# EAGLE design QuadOpAmp (EAGLE 7.2.0)
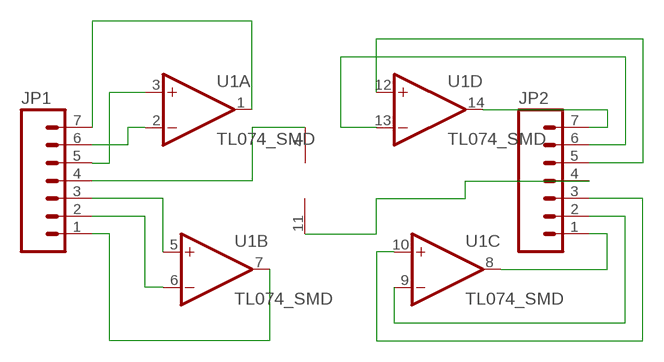
[diagram p0: schematic, sheet 1]

## Parts
JP1  M07LOCK  [1X07_LOCK]
JP2  M07LOCK  [1X07_LOCK]
U1  TL074_SMD  [SO14]

## Nets
N$1: JP1.1 U1.7(B:OUT)
N$2: JP1.2 U1.6(B:-IN)
N$3: JP1.3 U1.5(B:+IN)
N$5: JP1.7 U1.1(A:OUT)
N$6: JP1.6 U1.2(A:-IN)
N$7: JP1.5 U1.3(A:+IN)
N$9: JP2.1 U1.8(C:OUT)
N$10: JP2.2 U1.9(C:-IN)
N$11: JP2.3 U1.10(C:+IN)
N$12: JP2.7 U1.14(D:OUT)
N$13: JP2.6 U1.13(D:-IN)
N$14: JP2.5 U1.12(D:+IN)
PWR+: JP1.4 U1.4(P:V+)
PWR-: JP2.4 U1.11(P:V-)

## Library data of the parts
JP1 JP2 = SparkFun-Connectors:M07: Header 7 Standard 7-pin 0.1" header. Use with straight break away headers (SKU : PRT-00116), right angle break away headers (PRT-00553), swiss pins (PRT-00743), machine pins (PRT-00117), and female headers (PRT-00115). NOTES ON THE VARIANTS LOCK and LOCK_LONGPADS... This footprint was designed to help hold the alignment of a through-hole component (i.e. 7-pin header) while soldering it into place. You may notice that each hole has been shifted either up or down by 0.005 of an inch from it's more standard position (which is usually a perfectly straight line). This slight alteration caused the pins (the squares in the middle) to touch the edges of the holes. Because they are alternating, it causes a "brace" to hold the header in place. 0.005 has proven to be the perfect amount of "off-center" position when using our standard breakaway headers. Although looks a little odd when you look at the bare footprint, once you have a header in there, the alteration is very hard to notice. Also, if you push a header all the way into place, it is covered up entirely on the bottom side. This idea of altering the position of holes to aid alignment will be further integrated into the Sparkfun Library for other footprints. It can help hold any component with 3 or more connection pins.
U1 = MusicThingModular:TL074: Generic Quad Op Amp

## Board
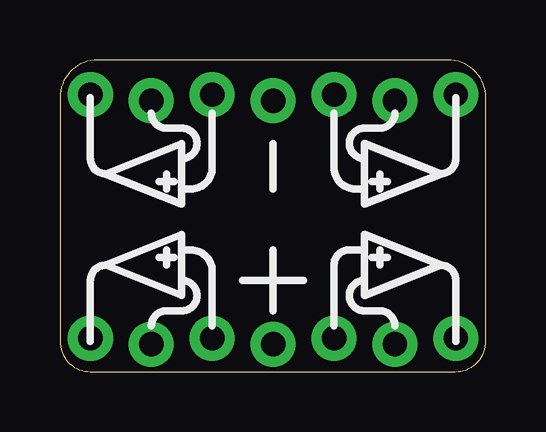
[diagram p1: board, top side]
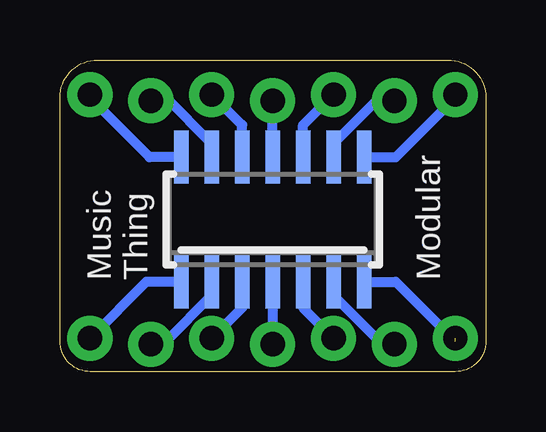
[diagram p2: board, bottom side, seen from below]

Size 17.76 x 13.01 mm. Coordinates in mm from the lower left corner, seen from the top.
Outline: 1.27,0 16.49,0 arc90 17.76,1.27 17.76,11.43 arc90 16.18,13.01 1.57,13.01 arc90 0,11.43 0,1.27 arc90 1.27,0
Copper layers (1*16): Top 0.035mm / dielectric 1.5mm / Bottom 0.035mm
Design rules "default": minimum track width 10mil, minimum drill 24mil, track to track 8mil, track to pad 8mil, pad to pad 8mil, via to via 8mil, smd to smd 8mil, copper to edge 40mil, drill to drill 8mil, minimum pad ring 10mil, minimum via ring 8mil, stop-mask expansion 4mil, vias tented up to drill 0mil, thermal gap 10mil

### Footprints (pad centres in the part's own frame; a part is rotated, then mirrored left to right if it is on the bottom)
1X07_LOCK = drill 1.016 pad 1.88: 1 0,0.127; 2 2.54,-0.127; 3 5.08,0.127; 4 7.62,-0.127; 5 10.16,0.127; 6 12.7,-0.127; 7 15.24,0.127
SO14 = smd 0.6 x 2.2: 1 -3.81,-2.6; 2 -2.54,-2.6; 3 -1.27,-2.6; 4 0,-2.6; 5 1.27,-2.6; 6 2.54,-2.6; 7 3.81,-2.6; 8 3.81,2.6; 9 2.54,2.6; 10 1.27,2.6; 11 0,2.6; 12 -1.27,2.6; 13 -2.54,2.6; 14 -3.81,2.6

### Placement (x,y rotation side)
JP1  1.27,1.27 0 top
JP2  1.27,11.43 0 top
U1  8.89,6.35 0 bottom

### Tracks (layer width: path | path; a pad name or v marks a point on that pad's centre or on a via)
N$1  (1 unrouted)
  Bottom 0.406: U1.7 3.75,3.75 1.27,1.27
N$2
  Bottom 0.406: U1.6 6.35,3.17 4.45,1.27 3.94,1.27 JP1.2
N$3
  Bottom 0.406: U1.5 7.62,2.67 JP1.3
N$5
  Bottom 0.406: U1.1 14.16,3.75 JP1.7
N$6
  Bottom 0.406: U1.2 11.43,3.17 13.34,1.27 13.84,1.27 JP1.6
N$7
  Bottom 0.406: U1.3 10.16,2.67 JP1.5
N$9
  Bottom 0.406: U1.8 3.75,8.95 1.27,11.43 JP2.1
N$10
  Bottom 0.406: U1.9 6.35,9.53 4.45,11.43 3.94,11.43 JP2.2
N$11
  Bottom 0.406: U1.10 7.62,10.29 JP2.3
N$12
  Bottom 0.406: U1.14 14.03,8.95 16.51,11.43 JP2.7
N$13
  Bottom 0.406: U1.13 11.43,9.53 13.34,11.43 13.84,11.43 JP2.6
N$14
  Bottom 0.406: U1.12 10.16,10.29 JP2.5
PWR+
  Bottom 0.406: U1.4 JP1.4
PWR-
  Bottom 0.406: U1.11 JP2.4

### Text on the board
bPlace: Music / Thing / / / / / / / / Modular